# Altium schematic sheet DSO_Trig.SchDoc: Schematic_Name
size A4; CompanyName: University of Melbourne; Engineer: Your Name Here; DocumentNumber: 1; Revision: 0.1; SheetNumber: 1; SheetTotal: 1; Title_Project: Project_Title; StudentNo: Student No.
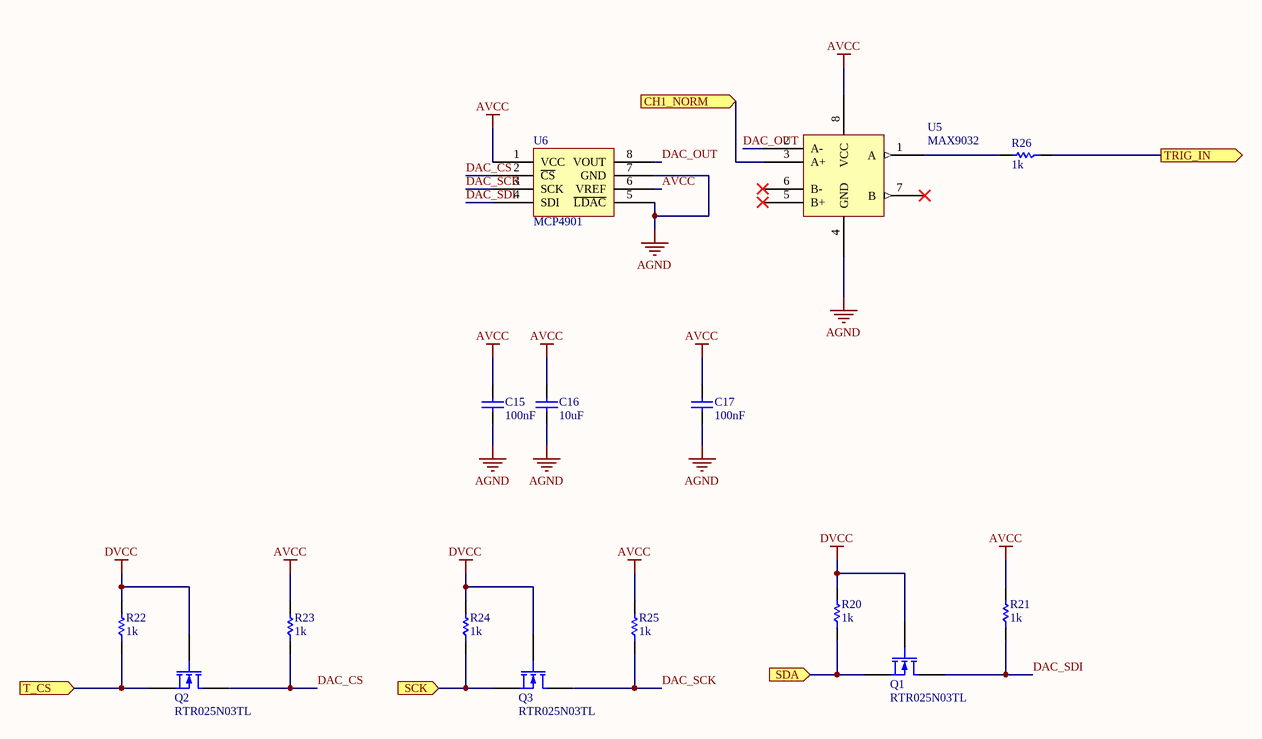
[diagram p0: DSO_Trig.SchDoc]

## Parts
C15  100nF  [0805C]
C16  10uF  [0805C]
C17  100nF  [0805C]
Q1  RTR025N03TL  [SOT23]
Q2  RTR025N03TL  [SOT23]
Q3  RTR025N03TL  [SOT23]
R20  1k  [0805]
R21  1k  [0805]
R22  1k  [0805]
R23  1k  [0805]
R24  1k  [0805]
R25  1k  [0805]
R26  1k  [0805]
U5  MAX9032  [SOIC-8]
U6  MCP4901  [SOIC-8]

## Ports
CH1_NORM (in), SCK (in), SDA (in), T_CS (in), TRIG_IN (out)

## Nets
AGND: C15.2 C16.2 C17.2 U5.4(GND) U6.5(~{LDAC}) U6.7(GND)
AVCC: C15.1 C16.1 C17.1 R21.2 R23.2 R25.2 U5.8(VCC) U6.1(VCC) U6.6(VREF)
DVCC: Q1.1 Q2.1 Q3.1 R20.2 R22.2 R24.2
CH1_NORM: U5.3(A+) ; port CH1_NORM
DAC_CS: Q2.3 R23.1 U6.2(~{CS})
DAC_OUT: U5.2(A-) U6.8(VOUT)
DAC_SCK: Q3.3 R25.1 U6.3(SCK)
DAC_SDI: Q1.3 R21.1 U6.4(SDI)
SCK: Q3.2 R24.1 ; port SCK
SDA: Q1.2 R20.1 ; port SDA
T_CS: Q2.2 R22.1 ; port T_CS
TRIG_IN: R26.1 ; port TRIG_IN
NetR26_2: R26.2 U5.1(A)

Not connected (* = marked no-connect by the designer): U5 5(B+)* 6(B-)* 7(B)*

## Library data of the parts
C15-C17 = C: Capacitor; Reviewed by: RM - 2018/08/05; Revision: July-2002: Re-released for DXP Platform.; Supplier 1: *; Supplier Part Number 1: *
  C15 C17: Value: 100nF
  C16: Value: 10uF
Q1-Q3 = MOSFET-N: N-Channel MOSFET; PackageDocument: 1995/1996; Published: 8-Jun-2000; LatestRevisionDate: 17-Jul-2002; LatestRevisionNote: Re-released for DXP Platform.; PackageReference: E3; Publisher: Altium Limited
R20-R26 = R: Resistor; Reviewed by: RM - 2018/08/05; Supplier 1: *; Suppler Part Number 1: *; Value: 1k
U5 = MAX9032: Dual Comparator; Reviewed by: RM - 2018/08/05; Supplier 1: Digi-Key; Supplier Part Number 1: MAX9032ASA-ND
U6 = MCP4901: DAC 8bit SPI; Reviewed by: RM - 2018/08/05; Supplier 1: Digi-Key; Supplier Part Number 1: MCP4901-E/SN-ND